# EAGLE schematic FlowSensor (EAGLE 7.2.0)
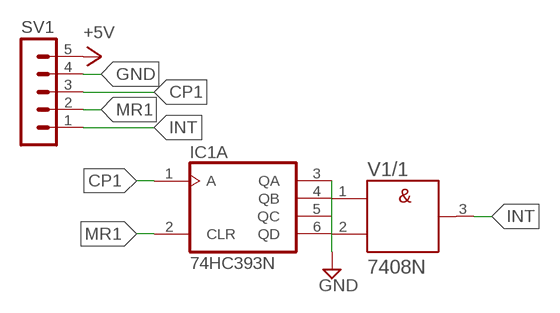
[diagram p0: schematic, sheet 1]

## Parts
IC1  74HC393N  [DIL14]
SV1  MA05-1  [MA05-1]
V1  7408N  [DIL14]

## Nets
CP1: IC1.1(A:A) SV1.3
GND: IC1.3(A:QA) IC1.5(A:QC) SV1.4
INT: SV1.1 V1.3(/1:Y)
MR1: IC1.2(A:CLR) SV1.2
N$1: IC1.4(A:QB) V1.1(/1:A)
N$2: IC1.6(A:QD) V1.2(/1:B)
VCC: SV1.5 ; supply symbol labelled +5V
Unconnected: IC1.8(B:QD) IC1.9(B:QC) IC1.10(B:QB) IC1.11(B:QA) IC1.12(B:CLR) IC1.13(B:A) V1.4(/2:A) V1.5(/2:B) V1.6(/2:Y) V1.8(/3:Y) V1.9(/3:A) V1.10(/3:B) V1.11(/4:Y) V1.12(/4:A) V1.13(/4:B)

## Power pins joined to a net without a drawn wire
+UB: V1.14(/+UB:+UB)
-UB: V1.7(/-UB:-UB)
GND: IC1.7(P:GND)
VCC: IC1.14(P:VCC)

## Library data of the parts
IC1 = 74xx-eu:74*393: Dual 4-bit decade and binary COUNTER
SV1 = con-lstb:MA05-1: PIN HEADER; OC_FARNELL: unknown; OC_NEWARK: unknown
V1 = 74ttl-din:74*08: Quad 2-input AND gate